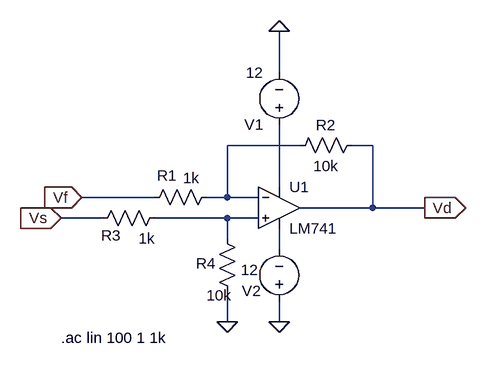
[diagram p0: schematic p2.asc]
p2.asc, the LTspice schematic file:
Version 4
SHEET 1 880 680
WIRE 208 -32 208 -96
WIRE 240 80 128 80
WIRE 352 80 320 80
WIRE 208 144 208 48
WIRE 16 160 -96 160
WIRE 128 160 128 80
WIRE 128 160 96 160
WIRE 176 160 128 160
WIRE 352 176 352 80
WIRE 352 176 240 176
WIRE 432 176 352 176
WIRE -64 192 -128 192
WIRE 128 192 16 192
WIRE 176 192 128 192
WIRE 128 224 128 192
WIRE 208 240 208 208
WIRE 128 352 128 304
WIRE 208 352 208 320
FLAG 128 352 0
FLAG 208 352 0
FLAG 208 -96 0
FLAG -96 160 Vf
IOPIN -96 160 In
FLAG -128 192 Vs
IOPIN -128 192 In
FLAG 432 176 Vd
IOPIN 432 176 Out
SYMBOL OpAmps\\LM741 208 112 R0
SYMATTR InstName U1
SYMBOL res 336 64 R90
WINDOW 0 0 56 VBottom 2
WINDOW 3 32 56 VTop 2
SYMATTR InstName R2
SYMATTR Value 10k
SYMBOL res 112 144 R90
WINDOW 0 -2 77 VBottom 2
WINDOW 3 -29 39 VTop 2
SYMATTR InstName R1
SYMATTR Value 1k
SYMBOL res 32 176 R90
WINDOW 0 58 83 VBottom 2
WINDOW 3 32 28 VTop 2
SYMATTR InstName R3
SYMATTR Value 1k
SYMBOL res 112 208 R0
WINDOW 0 -32 54 Left 2
WINDOW 3 -16 103 Left 2
SYMATTR InstName R4
SYMATTR Value 10k
SYMBOL voltage 208 64 R180
WINDOW 123 0 0 Left 0
WINDOW 39 0 0 Left 0
SYMATTR InstName V1
SYMATTR Value 12
SYMBOL voltage 208 336 R180
WINDOW 0 28 32 Left 2
WINDOW 3 32 64 Left 2
WINDOW 123 0 0 Left 0
WINDOW 39 0 0 Left 0
SYMATTR InstName V2
SYMATTR Value 12
TEXT -128 376 Left 2 !.ac lin 100 1 1k

The netlist it stands for:
* p2.asc
XU1 N003 N001 N002 N004 Vd LM741  ; pins In+ In- V+ V- OUT
R2 Vd N001 10k
R1 N001 Vf 1k
R3 N003 Vs 1k
R4 N003 0 10k
V1 N002 0 12
V2 0 N004 12
.ac lin 100 1 1k
.lib LM741.lib
.backanno
.end